# EAGLE design MIC (EAGLE 9.1.0)
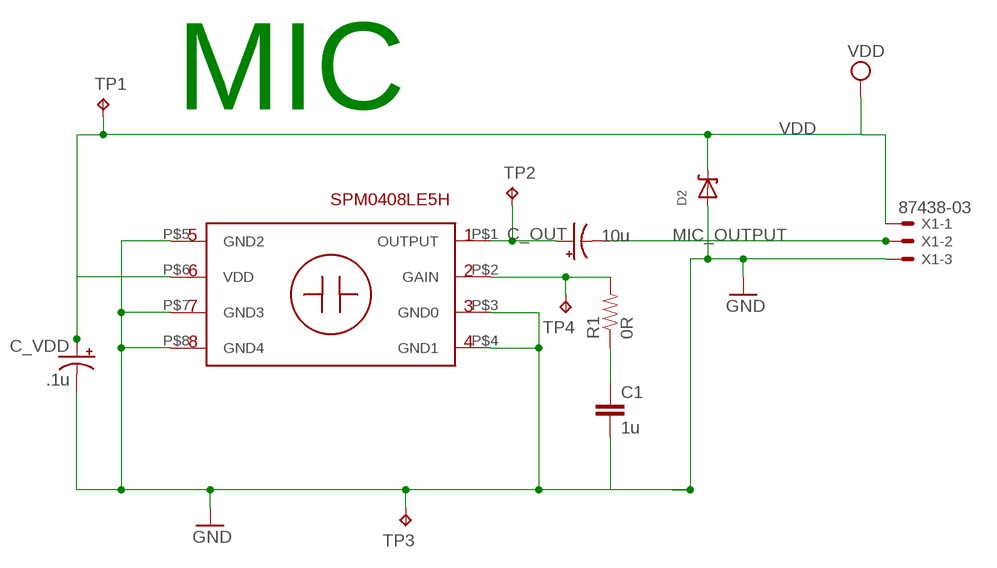
[diagram p0: schematic, sheet 1]

## Parts
C1  1u  CAP_0402  [0402]
C_OUT  10u  CAP_POL1206-KIT  [EIA3216-KIT]
C_VDD  .1u  CAP_POL1206-KIT  [EIA3216-KIT]
D2  DIODE-ZENERSOD123  [SOD-123]
R1  0R  RES_0402  [0402]
TP1  TPPAD1-17  [P1-17]
TP2  TPPAD1-17  [P1-17]
TP3  TPPAD1-17  [P1-17]
TP4  TPPAD1-17  [P1-17]
U2  SPM0408LE5H  [SPM0408LE5H-TB]
X1  87438-03  [87438-03]

## Nets
GND: C1.2 C_VDD.C(-) D2.A TP3.TP U2.P$3(GND0) U2.P$4(GND1) U2.P$5(GND2) U2.P$7(GND3) U2.P$8(GND4) X1.3
MIC_OUTPUT: C_OUT.C(-) X1.2
N$8: C_OUT.A(+) TP2.TP U2.P$1(OUTPUT)
N$35: R1.2 TP4.TP U2.P$2(GAIN)
N$36: C1.1 R1.1
VDD: C_VDD.A(+) D2.C TP1.TP U2.P$6(VDD) X1.1

## Notes on the sheet
- MIC
- SPM0408LE5H

## Library data of the parts
C1 = Perfect_0402:CAP_0402: 0402 (1005 Metric) Nick Garner - TeleSense
C_OUT = SparkFun-Passives:CAP_POL: Capacitor Polarized These are standard SMD and PTH capacitors. Normally 10uF, 47uF, and 100uF in electrolytic and tantalum varieties. Always verify the external diameter of the through hole cap, it varies with capacity, voltage, and manufacturer. The EIA devices should be standard.; MF: AVX; MPN: 0603ZD106MAT2A; OC_FARNELL: 1867954
C_VDD = SparkFun-Passives:CAP_POL: Capacitor Polarized These are standard SMD and PTH capacitors. Normally 10uF, 47uF, and 100uF in electrolytic and tantalum varieties. Always verify the external diameter of the through hole cap, it varies with capacity, voltage, and manufacturer. The EIA devices should be standard.; MF: VISHAY SPRAGUE; MPN: 293D106X96R3A2TE3; OC_FARNELL: 1754143
D2 = microbuilder:DIODE-ZENER: Zener Diode SMA: 30V 1W Zener Diode, 1.2Vf - Digikey: SMAZ30-FDICT-ND
R1 = Perfect_0402:RES_0402: 0402 (1005 Metric) Nick Garner - TeleSense
TP1-TP4 = testpad:TP: Test pad
U2 = acousticLib:SPM0408LE5H
X1 = con-molex:87438-03: Wire-to-Board 1.50mm (.059") Pitch Header - Right Angle, SMT, Shrouded Source: http://www.molex.com/product/micro/87438.html; MF: MOLEX; OC_FARNELL: 1711328; OC_NEWARK: unknown

## Net classes
0 default: width 0.152 mm, drill 0.305 mm, clearance 0.152 mm

## Board
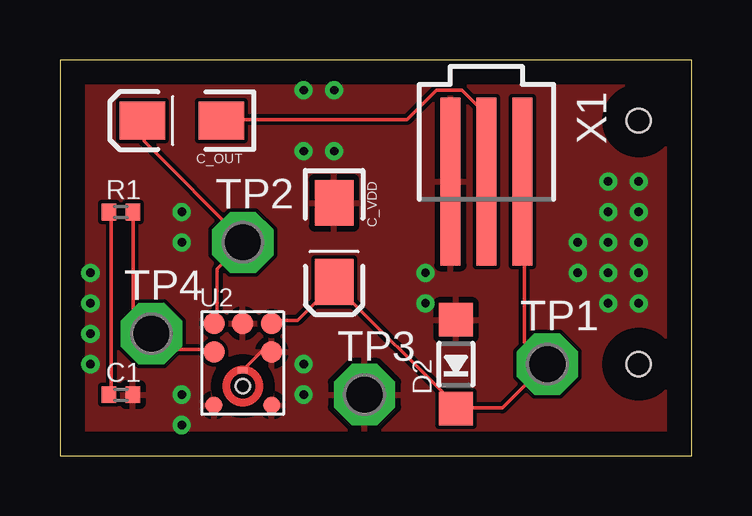
[diagram p1: board, top side]
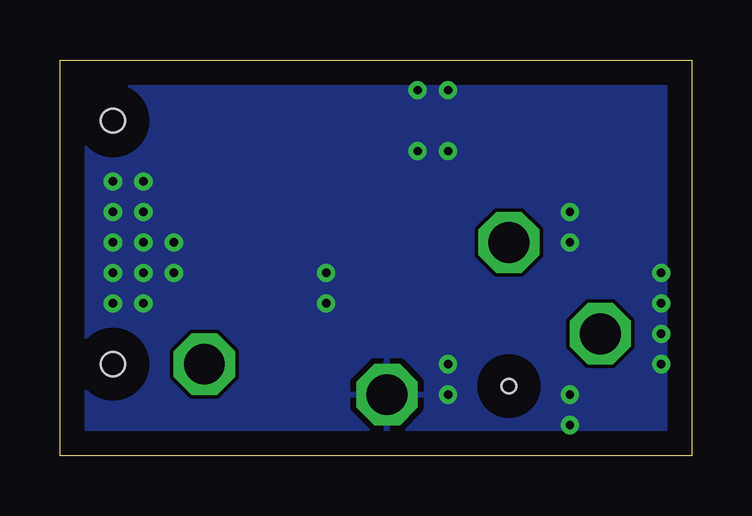
[diagram p2: board, bottom side, seen from below]

Size 26.34 x 16.5 mm. Coordinates in mm from the lower left corner, seen from the top.
Outline: 0,0 26.34,0 26.34,16.5 0,16.5 0,0
Copper layers (1*16): Top 0.035mm / dielectric 1.5mm / Bottom 0.035mm
Design rules "default": minimum track width 6mil, minimum drill 0.35mm, track to track 6mil, track to pad 6mil, pad to pad 6mil, via to via 6mil, smd to smd 6mil, copper to edge 40mil, drill to drill 6mil, minimum pad ring 10mil, minimum via ring 8mil, stop-mask expansion 4mil, vias tented up to drill 0mil, thermal gap 10mil
Holes 1 mm at 24.13,13.97 24.13,3.81

### Footprints (pad centres in the part's own frame; a part is rotated, then mirrored left to right if it is on the bottom)
0402 = smd 0.6 x 0.7: 1 -0.5,0; 2 0.5,0
EIA3216-KIT = smd 1.9 x 1.6: A 1.65,0; C -1.65,0
SOD-123 = smd 1.4 x 1.4: A 1.85,0; C -1.85,0
P1-17 = drill 1.702 pad 2.54 octagon: TP 0,0
SPM0408LE5H-TB = smd 0.9 x 0.9: P$1 -1.2,1.7; P$2 -1.2,0.506; P$5 1.208,0.506; P$6 1.208,1.7; P$7 0.004,1.7 | smd 0.7 x 0.7: P$3 -1.2,-1.706; P$4 1.208,-1.706 | smd 0.406 x 0.203: P$8 0,-0.26 | hole 0.6: 0.004,-0.916
87438-03 = smd 7 x 0.85: 1 0,1.5; 2 0,0; 3 0,-1.5

### Placement (x,y rotation side)
C1  2.54,2.54 0 top
C_OUT  5.08,13.97 180 top
C_VDD  11.43,8.89 270 top
D2  16.51,3.81 90 top
R1  2.54,10.16 0 top
TP1  20.32,3.81 0 top
TP2  7.62,8.89 0 top
TP3  12.7,2.54 0 top
TP4  3.81,5.08 0 top
U2  7.62,3.81 0 top
X1  17.78,11.43 270 top

### Tracks (layer width: path | path; a pad name or v marks a point on that pad's centre or on a via)
GND  (via drill 0.35)
  Top 0.152: U2.P$8 8.39,4.32 U2.P$5
  other vias: 10.16,15.24 11.43,15.24 22.86,11.43 24.13,11.43 5.08,8.89 5.08,10.16 1.27,6.35 1.27,7.62 1.27,3.81 1.27,5.08 22.86,8.89 24.13,8.89 22.86,7.62 24.13,7.62 21.59,7.62 21.59,8.89 22.86,6.35 24.13,6.35 22.86,10.16 24.13,10.16 15.24,6.35 15.24,7.62 10.16,12.7 11.43,12.7 10.16,2.54 10.16,3.81 5.08,1.27 5.08,2.54
  pour Top: 0,16.51 26.67,16.51 26.67,0 0,0
  pour Bottom: 0,16.51 26.67,16.51 26.67,0 0,0
MIC_OUTPUT
  Top 0.152: C_OUT.C 6.86,14.02 14.48,14.02 15.7,15.24 16.76,15.24 17.68,14.33 17.68,11.43 X1.2
N$8
  Top 0.152: U2.P$1 6.55,5.64 6.55,7.77 7.62,8.84 TP2.TP 7.62,8.99 3.5,13.11 3.5,13.87 C_OUT.A
N$35
  Top 0.152: R1.2 3.05,10.06 3.05,5.94 3.81,5.18 TP4.TP 3.81,5.03 4.42,4.42 6.4,4.42 U2.P$2
N$36
  Top 0.152: C1.1 2.13,2.59 2.13,10.06 R1.1
VDD
  Top 0.152: 11.43,7.16 9.91,5.64 8.84,5.64 U2.P$6 | 16.61,1.98 18.44,1.98 20.27,3.81 | 16.61,1.98 11.43,7.16 | 11.43,7.16 C_VDD.A | 16.61,1.98 D2.C | 20.27,3.81 19.36,4.72 19.36,11.43 X1.1 | 20.27,3.81 TP1.TP